# EasyEDA schematic Frozen Slimes v2.json
TITLE: Sheet_1; REV: 1.0; Date: 2023-01-04; Sheet: 1/1; Company: Your Company
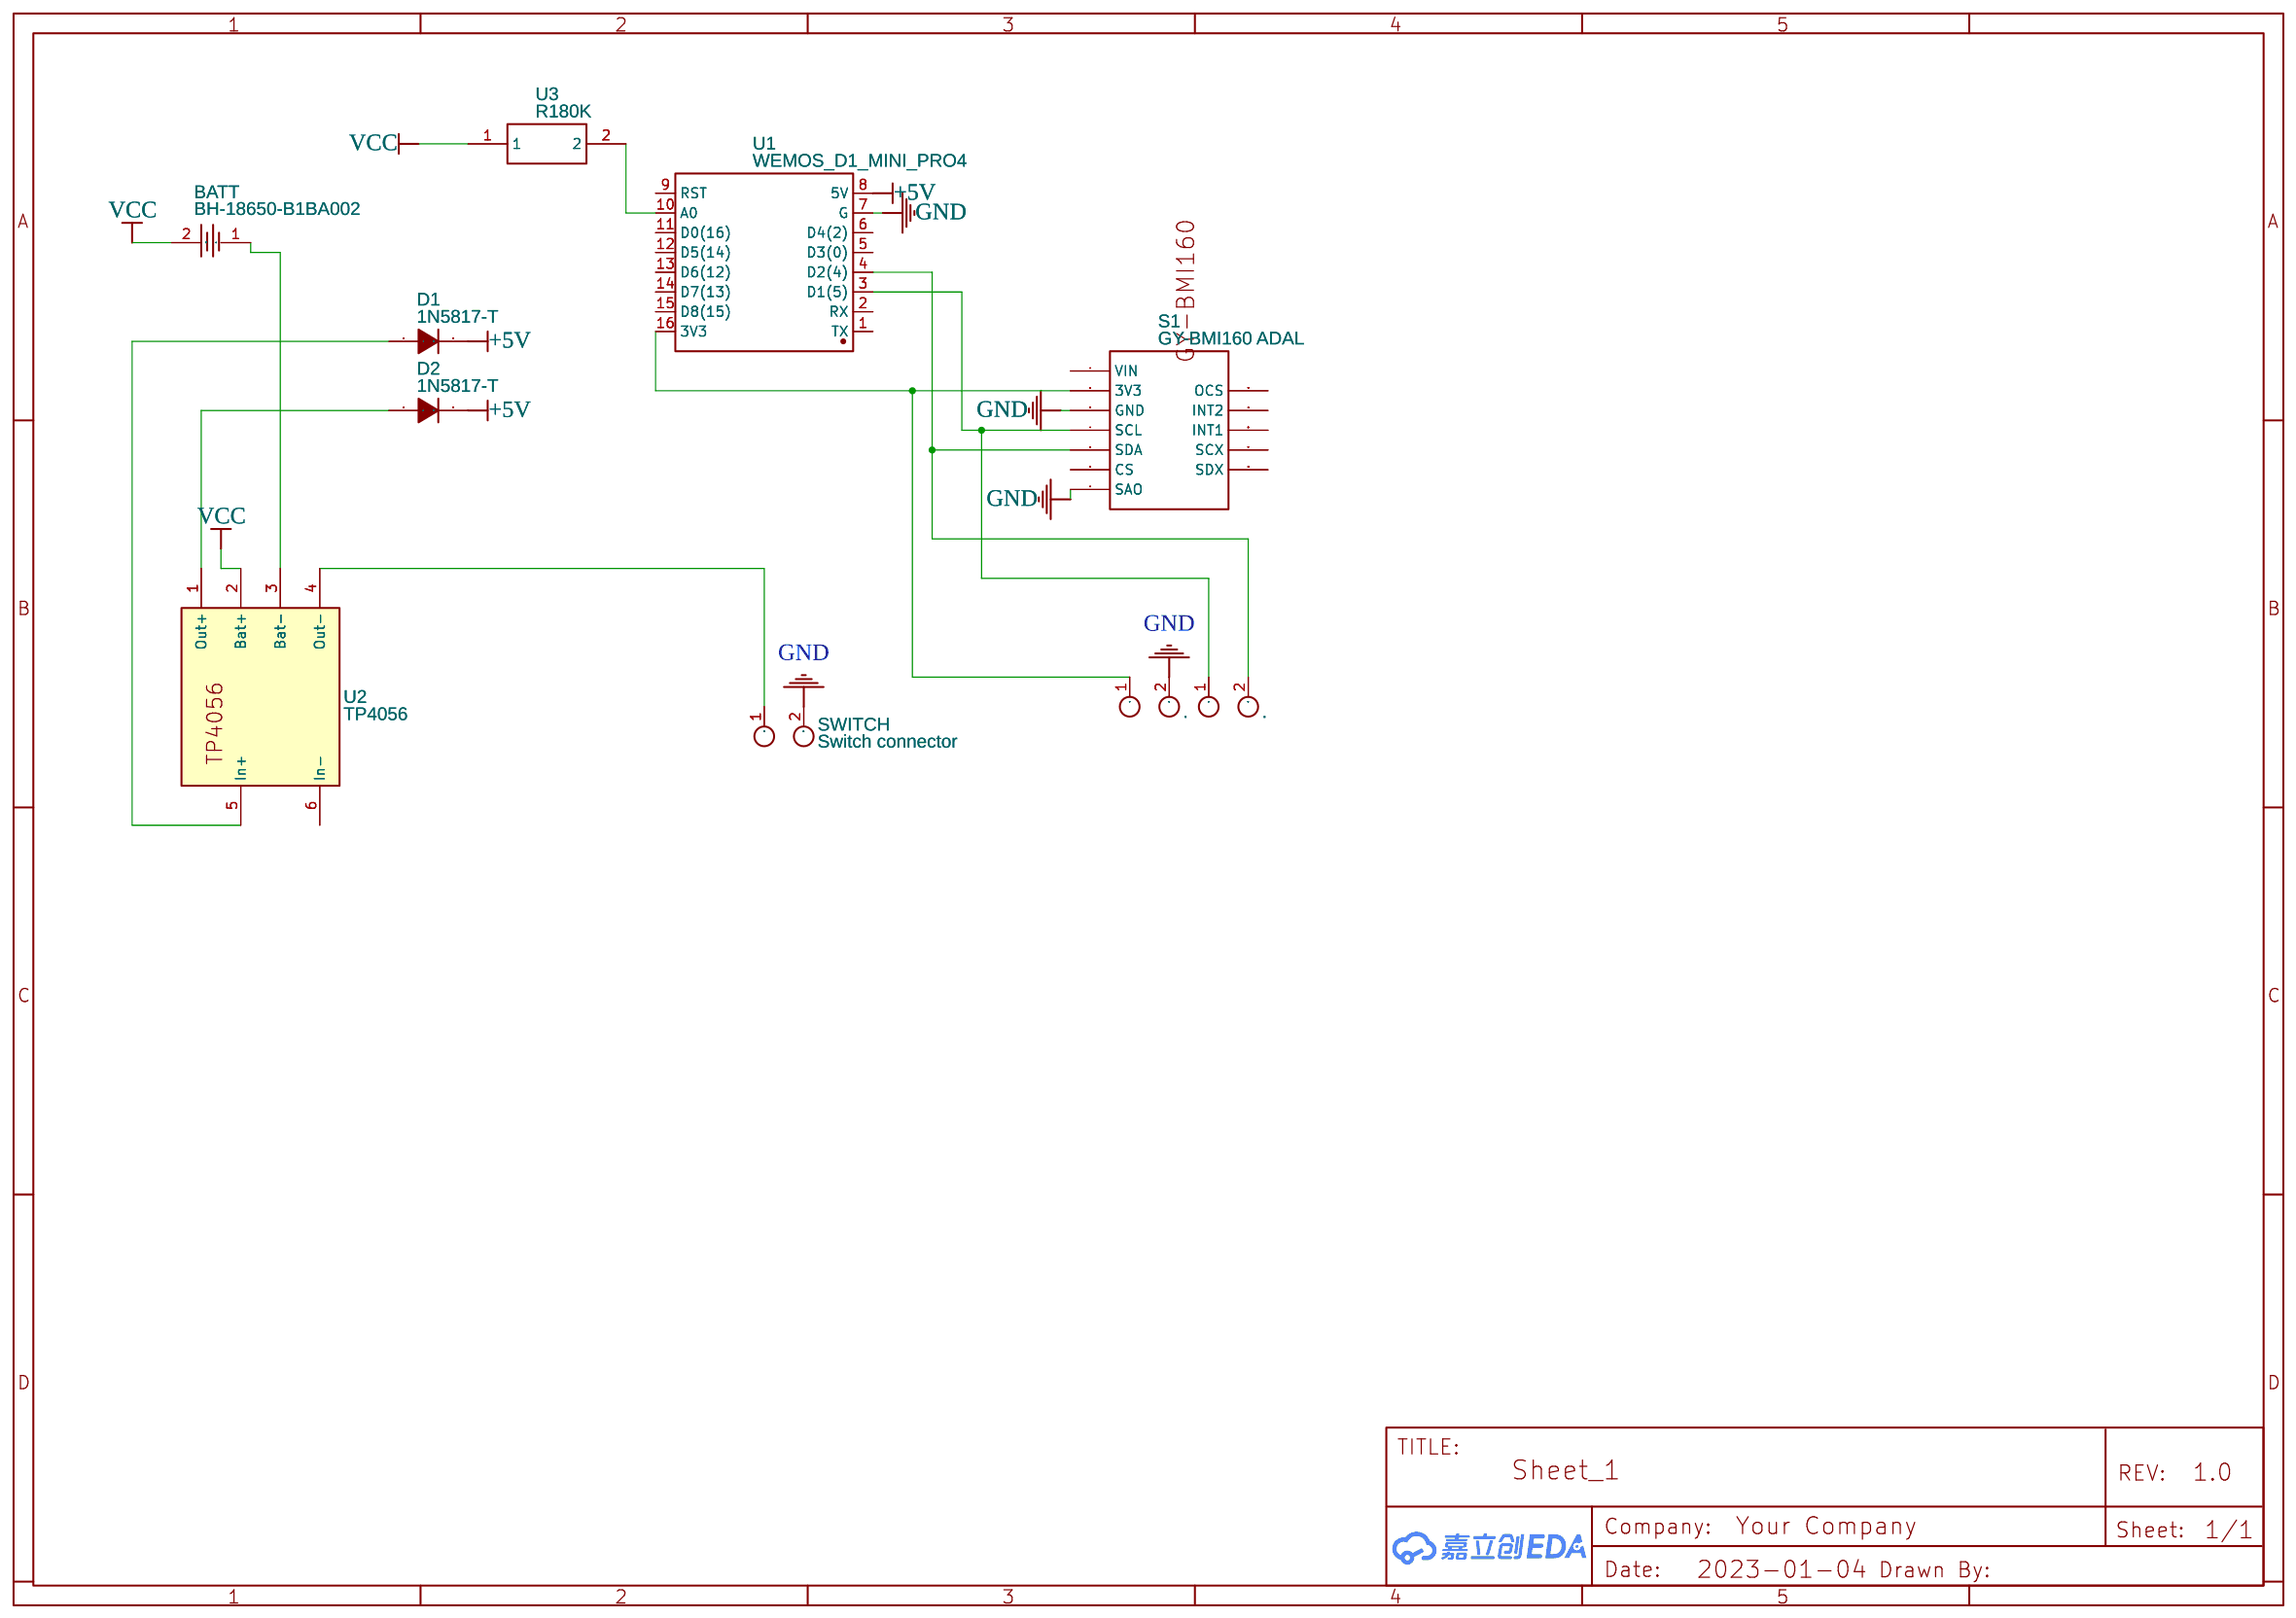
[diagram p0: schematic sheet]

## Parts
BATT  BH-18650-B1BA002  [BATTERY-SMD_18650-1S-L77.1-W20.7-1]
D1  1N5817-T  [DO-41_BD2.4-L4.7-P8.70-D0.9-FD]
D2  1N5817-T  [DO-41_BD2.4-L4.7-P8.70-D0.9-FD]
S1  GY-BMI160 ADAL  [GY-BMI160 ADAL]
SWITCH  Switch connector  [2XSOLDERPAD]
U1  WEMOS_D1_MINI_PRO4  [DIP-16_WEMOS_D1_MINI_PRO4]
U2  TP4056  [TP4056]
U3  R180K  [ER RESISTOR 180K/0.6 W]
U6  .  [2XSOLDERPAD]
U7  .  [2XSOLDERPAD]

## Library data of the parts
BATT = BH-18650-B1BA002: Supplier: LCSC; Supplier Part: C2988620; Manufacturer: MYOUNG(美阳); link: https://atta.szlcsc.com/upload/public/pdf/source/20220402/870DB99AB50CA0DF8D51CF7C86A51FAB.pdf; Contributor: lcsc; JLCPCB Part Class: Extended Part
D1 D2 = 1N5817-T: Supplier: LCSC; Supplier Part: C507852; Manufacturer: DIODES(美台); Contributor: LCSC; JLCPCB Part Class: Extended Part
S1 = GY-BMI160 ADAL: Supplier: Banggood; Contributor: adal
SWITCH U6 U7 = 2XSOLDER PAD: Contributor: matt_2969
U1 = WEMOS_D1_MINI_PRO4: Supplier: LCSC; Supplier Part: C2837266; Manufacturer: null; Manufacturer Part: Wemos_D1_mini_Pro4; Contributor: LCSC; JLCPCB Part Class: Extended Part
U2 = TP4056: Contributor: defdjamel2008
U3 = R180K: Contributor: Witlon

## Nets
+5V: D1.2(K) D2.2(K) U1.8(5V)
GND: S1.1(SAO) S1.5(GND) SWITCH.2 U1.7(G) U6.2
VCC: BATT.2 U2.2(Bat+) U3.1
Net-(BATT-1): BATT.1 U2.3(Bat-)
Net-(D1-1): D1.1(A) U2.5(In+)
Net-(D2-1): D2.1(A) U2.1(Out+)
Net-(S1-3): S1.3(SDA) U1.4(D2(4)) U7.2
Net-(S1-4): S1.4(SCL) U1.3(D1(5)) U7.1
Net-(S1-6): S1.6(3V3) U1.16(3V3) U6.1
Net-(SWITCH-1): SWITCH.1 U2.4(Out-)
Net-(U1-10): U1.10(A0) U3.2

Not connected (* = marked no-connect by the designer): S1 2(CS) 7(VIN) 8(OCS) 9(INT2) 10(INT1) 11(SCX) 12(SDX); U1 1(TX) 2(RX) 5(D3(0)) 6(D4(2)) 9(RST) 11(D0(16)) 12(D5(14)) 13(D6(12)) 14(D7(13)) 15(D8(15)); U2 6(In-)
